# Altium schematic sheet MyECGSheet.SchDoc
size 203 x 152 mm
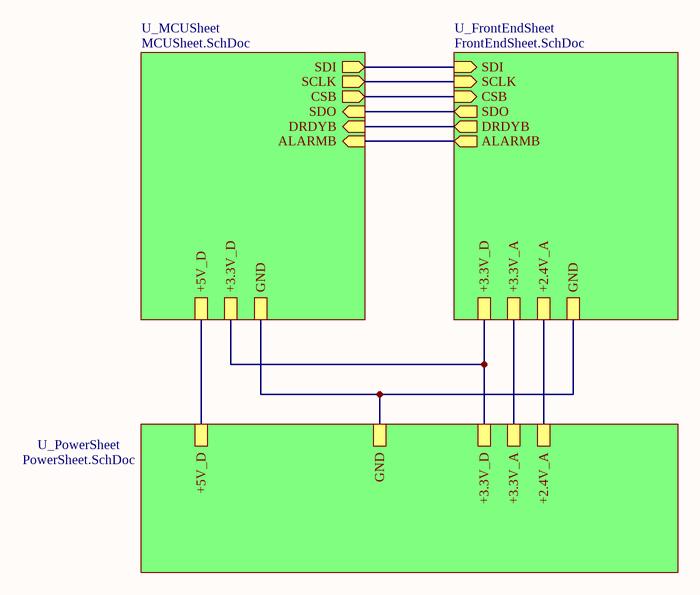
[diagram p0: MyECGSheet.SchDoc]

## Sub-sheets
U_FrontEndSheet = FrontEndSheet.SchDoc: DRDYB (out), SDO (out), SDI (in), SCLK (in), CSB (in), ALARMB (out), +3.3V_D, +3.3V_A, +2.4V_A, GND
U_MCUSheet = MCUSheet.SchDoc: +3.3V_D, GND, SDO (in), SDI (out), SCLK (out), CSB (out), DRDYB (in), ALARMB (in), +5V_D
U_PowerSheet = PowerSheet.SchDoc: GND, +5V_D, +3.3V_D, +3.3V_A, +2.4V_A

## Nets
(unnamed): sheet U_PowerSheet/GND, sheet U_FrontEndSheet/GND, sheet U_MCUSheet/GND
(unnamed): sheet U_PowerSheet/+5V_D, sheet U_MCUSheet/+5V_D
(unnamed): sheet U_PowerSheet/+3.3V_D, sheet U_FrontEndSheet/+3.3V_D, sheet U_MCUSheet/+3.3V_D
(unnamed): sheet U_PowerSheet/+3.3V_A, sheet U_FrontEndSheet/+3.3V_A
(unnamed): sheet U_PowerSheet/+2.4V_A, sheet U_FrontEndSheet/+2.4V_A
(unnamed): sheet U_FrontEndSheet/DRDYB, sheet U_MCUSheet/DRDYB
(unnamed): sheet U_FrontEndSheet/SDO, sheet U_MCUSheet/SDO
(unnamed): sheet U_FrontEndSheet/SDI, sheet U_MCUSheet/SDI
(unnamed): sheet U_FrontEndSheet/SCLK, sheet U_MCUSheet/SCLK
(unnamed): sheet U_FrontEndSheet/CSB, sheet U_MCUSheet/CSB
(unnamed): sheet U_FrontEndSheet/ALARMB, sheet U_MCUSheet/ALARMB